# EAGLE schematic a320-polyvoks-vcf (EAGLE 7.6.0)
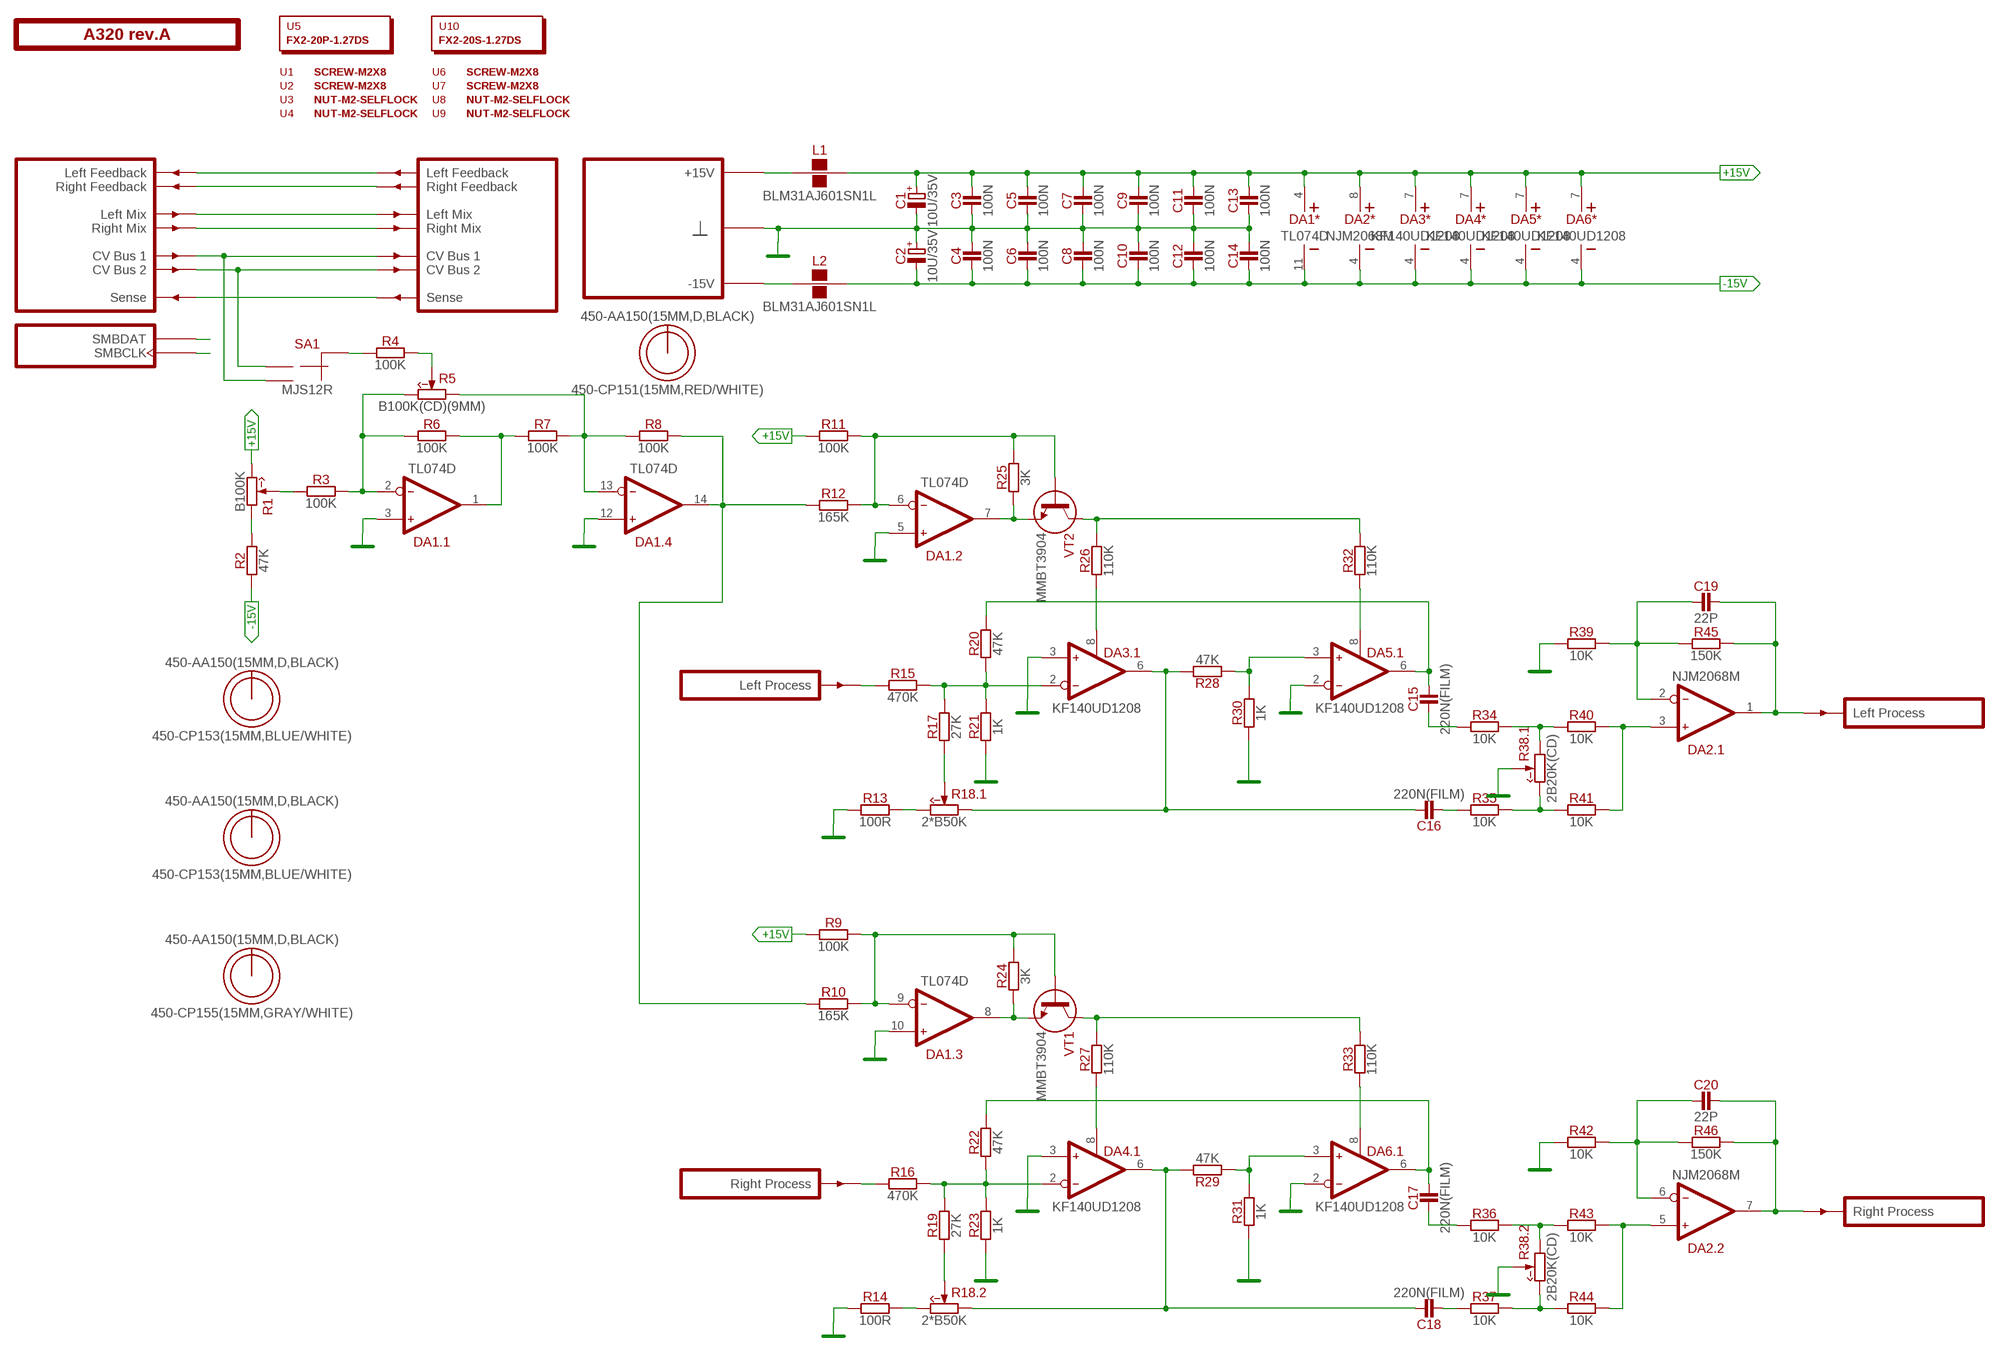
[diagram p0: schematic, sheet 1]

## Parts
C1  10U/35V  [E2-5]
C2  10U/35V  [E2-5]
C3  100N  [C-0805]
C4  100N  [C-0805]
C5  100N  [C-0805]
C6  100N  [C-0805]
C7  100N  [C-0805]
C8  100N  [C-0805]
C9  100N  [C-0805]
C10  100N  [C-0805]
C11  100N  [C-0805]
C12  100N  [C-0805]
C13  100N  [C-0805]
C14  100N  [C-0805]
C15  220N(FILM)  [C050-025X075]
C16  220N(FILM)  [C050-025X075]
C17  220N(FILM)  [C050-025X075]
C18  220N(FILM)  [C050-025X075]
C19  22P  [C-0805]
C20  22P  [C-0805]
DA1  TL074D  [SO-14]
DA2  NJM2068M  [SO-8]
DA3  KF140UD1208  [SO-8]
DA4  KF140UD1208  [SO-8]
DA5  KF140UD1208  [SO-8]
DA6  KF140UD1208  [SO-8]
L1  BLM31AJ601SN1L  [1206]
L2  BLM31AJ601SN1L  [1206]
O1  450-AA150(15MM,D,BLACK)  [EMPTY]
O2  450-CP153(15MM,BLUE/WHITE)  [EMPTY]
O3  450-AA150(15MM,D,BLACK)  [EMPTY]
O4  450-CP153(15MM,BLUE/WHITE)  [EMPTY]
O5  450-AA150(15MM,D,BLACK)  [EMPTY]
O6  450-CP155(15MM,GRAY/WHITE)  [EMPTY]
O7  450-AA150(15MM,D,BLACK)  [EMPTY]
O8  450-CP151(15MM,RED/WHITE)  [EMPTY]
PCB1  A320 rev.A  ST2-BOARD-50  [ST2-BOARD-50]
R1  B100K  [RV11-SINGLE]
R2  47K  [R-0805]
R3  100K  [R-0805]
R4  100K  [R-0805]
R5  B100K(CD)(9MM)  [RV09-SINGLE]
R6  100K  [R-0805]
R7  100K  [R-0805]
R8  100K  [R-0805]
R9  100K  [R-0805]
R10  165K  [R-0805]
R11  100K  [R-0805]
R12  165K  [R-0805]
R13  100R  [R-0805]
R14  100R  [R-0805]
R15  470K  [R-0805]
R16  470K  [R-0805]
R17  27K  [R-0805]
R18  2*B50K  2B50K  [RV11-DUAL]
R19  27K  [R-0805]
R20  47K  [R-0805]
R21  1K  [R-0805]
R22  47K  [R-0805]
R23  1K  [R-0805]
R24  3K  [R-0805]
R25  3K  [R-0805]
R26  110K  [R-0805]
R27  110K  [R-0805]
R28  47K  [R-0805]
R29  47K  [R-0805]
R30  1K  [R-0805]
R31  1K  [R-0805]
R32  110K  [R-0805]
R33  110K  [R-0805]
R34  10K  [R-0805]
R35  10K  [R-0805]
R36  10K  [R-0805]
R37  10K  [R-0805]
R38  2B20K(CD)  [RV11-DUAL]
R39  10K  [R-0805]
R40  10K  [R-0805]
R41  10K  [R-0805]
R42  10K  [R-0805]
R43  10K  [R-0805]
R44  10K  [R-0805]
R45  150K  [R-0805]
R46  150K  [R-0805]
SA1  MJS12R  [APEM-MJS12R]
U1  SCREW-M2X8  [EMPTY]
U2  SCREW-M2X8  [EMPTY]
U3  NUT-M2-SELFLOCK  [EMPTY]
U4  NUT-M2-SELFLOCK  [EMPTY]
U5  FX2-20P-1.27DS  [EMPTY]
U6  SCREW-M2X8  [EMPTY]
U7  SCREW-M2X8  [EMPTY]
U8  NUT-M2-SELFLOCK  [EMPTY]
U9  NUT-M2-SELFLOCK  [EMPTY]
U10  FX2-20S-1.27DS  [EMPTY]
VT1  MMBT3904  [SOT23]
VT2  MMBT3904  [SOT23]

## Nets
+15V: C1.+ C3.2 C5.2 C7.2 C9.2 C11.2 C13.2 DA1.4(*:V+) DA2.8(*:V+) DA3.7(*:V+) DA4.7(*:V+) DA5.7(*:V+) DA6.7(*:V+) L1.2 R1.3(CW) R9.1 R11.1
-15V: C2.- C4.1 C6.1 C8.1 C10.1 C12.1 C14.1 DA1.11(*:V-) DA2.4(*:V-) DA3.4(*:V-) DA4.4(*:V-) DA5.4(*:V-) DA6.4(*:V-) L2.2 R2.1
GND: C1.- C2.+ C3.1 C4.2 C5.1 C6.2 C7.1 C8.2 C9.1 C10.2 C11.1 C12.2 C13.1 C14.2 DA1.3(.1:IN+) DA1.5(.2:IN+) DA1.10(.3:IN+) DA1.12(.4:IN+) DA3.3(.1:IN+) DA4.3(.1:IN+) DA5.2(.1:IN-) DA6.2(.1:IN-) PCB1.B4'(GND) PCB1.B4(GND) PCB1.B5'(GND) PCB1.B5(GND) PCB1.B6'(GND) PCB1.B6(GND) PCB1.B7'(GND) PCB1.B7(GND) PCB1.B8'(GND) PCB1.B8(GND) R13.1 R14.1 R21.1 R23.1 R30.1 R31.1 R38.2'(.2:W) R38.2(.1:W) R39.1 R42.1
LMIX: PCB1.ALMIX'(LMIX') PCB1.ALMIX(LMIX)
N$1: L1.1 PCB1.A+15'(P+15V) PCB1.A+15(P+15V) PCB1.B+15'(P+15V) PCB1.B+15(P+15V)
N$2: PCB1.ALFBK'(LFBK') PCB1.ALFBK(LFBK)
N$3: R4.2 R5.2(W)
N$4: PCB1.ARFBK'(RFBK') PCB1.ARFBK(RFBK)
N$5: DA1.2(.1:IN-) R3.2 R5.3(CW) R6.1
N$6: DA1.1(.1:OUT) R6.2 R7.1
N$7: DA1.13(.4:IN-) R5.1(CCW) R7.2 R8.1
N$8: R1.1(CCW) R2.2
N$9: R4.1 SA1.C(CM)
N$10: R34.2 R38.1(.1:CCW) R40.1
N$11: DA1.9(.3:IN-) R9.2 R10.2 R24.2 VT1.1(B)
N$12: DA1.6(.2:IN-) R11.2 R12.2 R25.2 VT2.1(B)
N$13: R1.2(W) R3.1
N$14: DA1.8(.3:OUT) R24.1 VT1.2(E)
N$15: PCB1.ACV1'(CV1') PCB1.ACV1(CV1) SA1.NO
N$16: PCB1.BSENSE'(SENSE') PCB1.BSENSE(SENSE)
N$17: DA1.7(.2:OUT) R25.1 VT2.2(E)
N$18: DA2.3(.1:IN+) R40.2 R41.2
N$19: R36.2 R38.1'(.2:CCW) R43.1
N$20: C19.2 DA2.1(.1:OUT) PCB1.BOUTL'(OUTL) R45.2
N$21: C20.1 DA2.6(.2:IN-) R42.2 R46.1
N$22: DA3.2(.1:IN-) R15.2 R17.2 R20.1 R21.2
N$23: C16.2 DA3.6(.1:OUT) R18.1(.1:CCW) R28.2
N$24: DA5.3(.1:IN+) R28.1 R30.2
N$25: L2.1 PCB1.A-15'(P-15V) PCB1.A-15(P-15V) PCB1.B-15'(P-15V) PCB1.B-15(P-15V)
N$26: DA3.8(.1:ISET) R26.1
N$27: C15.2 DA5.6(.1:OUT) R20.2
N$28: DA1.14(.4:OUT) R8.2 R10.1 R12.1
N$29: R13.2 R18.3(.1:CW)
N$30: R17.1 R18.2(.1:W)
N$31: DA5.8(.1:ISET) R32.1
N$32: R26.2 R32.2 VT2.3(C)
N$33: C15.1 R34.1
N$34: C16.1 R35.1
N$35: DA2.5(.2:IN+) R43.2 R44.2
N$36: R37.2 R38.3'(.2:CW) R44.1
N$37: C20.2 DA2.7(.2:OUT) PCB1.BOUTR'(OUTR) R46.2
N$38: PCB1.ASMBDAT'(SMBDAT) PCB1.ASMBDAT(SMBDAT)
N$39: DA4.2(.1:IN-) R16.2 R19.2 R22.1 R23.2
N$40: C18.2 DA4.6(.1:OUT) R18.1'(.2:CCW) R29.2
N$41: DA6.3(.1:IN+) R29.1 R31.2
N$42: PCB1.ACV2'(CV2') PCB1.ACV2(CV2) SA1.NC
N$43: PCB1.ASMBCLK'(SMBCLK) PCB1.ASMBCLK(SMBCLK)
N$44: C17.2 DA6.6(.1:OUT) R22.2
N$45: R14.2 R18.3'(.2:CW)
N$46: R18.2'(.2:W) R19.1
N$47: DA4.8(.1:ISET) R27.1
N$48: DA6.8(.1:ISET) R33.1
N$49: R27.2 R33.2 VT1.3(C)
N$50: R35.2 R38.3(.1:CW) R41.1
N$51: C17.1 R36.1
N$52: C18.1 R37.1
N$53: PCB1.BINL(INL) R15.1
N$54: PCB1.BINR(INR) R16.1
N$64: C19.1 DA2.2(.1:IN-) R39.2 R45.1
RMIX: PCB1.ARMIX'(RMIX') PCB1.ARMIX(RMIX)

## Library data of the parts
C1 C2 = capacitors-electrolytic:?; MOUSER: 647-USW1V100MDD
C3-C14 = capacitors:?; MOUSER: 77-VJ0805V104MXBPBC
C15-C18 = capacitors:?; MOUSER: 80-R82DC3220AA60J
C19 C20 = capacitors:?; MOUSER: 77-VJ0805A220GXACBC
DA1 = ic-ti:TL074
DA2 = ic-jrc:NJM2068; MOUSER: 513-NJM2068M
DA3-DA6 = ic-alfa-rpar:KF140UD1208
L1 L2 = inductors:BLM31AJ601SN1L; MOUSER: 81-BLM31AJ601SN1L
O1 O3 O5 O7 = hardware:450-AA?; MOUSER: 450-AA150
O2 O4 = hardware:450-C?; MOUSER: 450-CP153
O6 = hardware:450-C?; MOUSER: 450-CP155
O8 = hardware:450-C?
PCB1 = module-footprints:ST2-BOARD-?
R1 = potentiometers:?
R2 R20 R22 R28 R29 = resistors:?; MOUSER: 660-RK73H2ATTD4702F
R3 R4 R6-R9 R11 = resistors:?; MOUSER: 660-RK73H2ATTD1003F
R5 = potentiometers:?; MOUSER: 652-PTV09A-4225FB104
R10 R12 = resistors:?; MOUSER: 660-RK73H2ATTD1653F
R13 R14 = resistors:?; MOUSER: 660-RK73H2ATTD1000F
R15 R16 = resistors:?; MOUSER: 660-RK73H2ATTD4703F
R17 R19 = resistors:?; MOUSER: 660-RK73H2ATTD2702F
R18 = potentiometers:2**?
R21 R23 R30 R31 = resistors:?; MOUSER: 660-RK73H2ATTD1001F
R24 R25 = resistors:?; MOUSER: 660-RK73H2ATTD3001F
R26 R27 R32 R33 = resistors:?; MOUSER: 660-RK73H2ATTD1103F
R34-R37 R39-R44 = resistors:?; MOUSER: 660-RK73H2ATTD1002F
R38 = potentiometers:2**?; MOUSER: 688-RK12L1230C1M
R45 R46 = resistors:?; MOUSER: 660-RK73H2ATTD1503F
SA1 = switches:MJS12R; MOUSER: 642-MJS12R
U1-U4 U6-U9 = hardware:*?
U5 = hardware:?; MOUSER: 798-FX2-20P-1.27DS71
U10 = hardware:?; MOUSER: 798-FX2-20S-1.27DS71
VT1 VT2 = transistors-npn:?; MOUSER: 771-MMBT3904T/R